# Altium schematic sheet Nestling_2.1_EXB_MPU6050.SchDoc
size A4
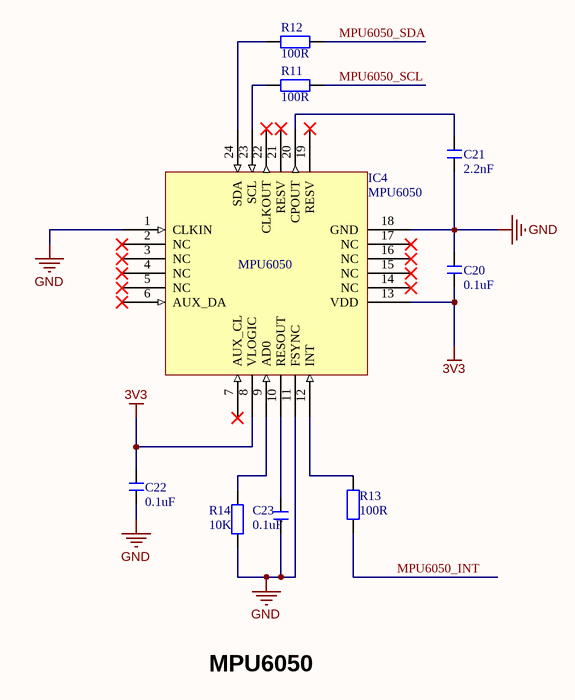
[diagram p0: Nestling_2.1_EXB_MPU6050.SchDoc]

## Parts
C20  0.1uF  [C 0603_M]
C21  2.2nF  [C 0603_M]
C22  0.1uF  [C 0603_M]
C23  0.1uF  [C 0603_M]
IC4  MPU6050  [QFN24 4x4_N]
R11  100R  [R 0603_M]
R12  100R  [R 0603_M]
R13  100R  [R 0603_M]
R14  10K  [R 0603_M]

## Nets
3V3: C20.2 C22.1 IC4.8(VLOGIC) IC4.13(VDD)
GND: C20.1 C21.2 C22.2 C23.2 IC4.1(CLKIN) IC4.11(FSYNC) IC4.18(GND) R14.2
MPU6050_INT: R13.1
MPU6050_SCL: R11.1
MPU6050_SDA: R12.1
NetC21_1: C21.1 IC4.20(CPOUT)
NetC23_1: C23.1 IC4.10(RESOUT)
NetIC4_9: IC4.9(AD0) R14.1
NetIC4_12: IC4.12(INT) R13.2
NetIC4_23: IC4.23(SCL) R11.2
NetIC4_24: IC4.24(SDA) R12.2

Not connected (* = marked no-connect by the designer): IC4 2(NC)* 3(NC)* 4(NC)* 5(NC)* 6(AUX_DA)* 7(AUX_CL)* 14(NC)* 15(NC)* 16(NC)* 17(NC)* 19(RESV)* 21(RESV)* 22(CLKOUT)*

## Notes on the sheet
- MPU6050

## Library data of the parts
C20-C23 = C: 无极性贴片电容; 版权归属: 源创客; BOM名称: 无极性贴片电容; 学习资源: www.ooocke.com
R11-R14 = RES: Resistor